# Altium schematic sheet Power.SchDoc
size A4; Organization: Altium Limited; Address1: L3, 12a Rodborough Rd; Address2: Frenchs Forest; Address3: NSW; Address4: Australia 2086
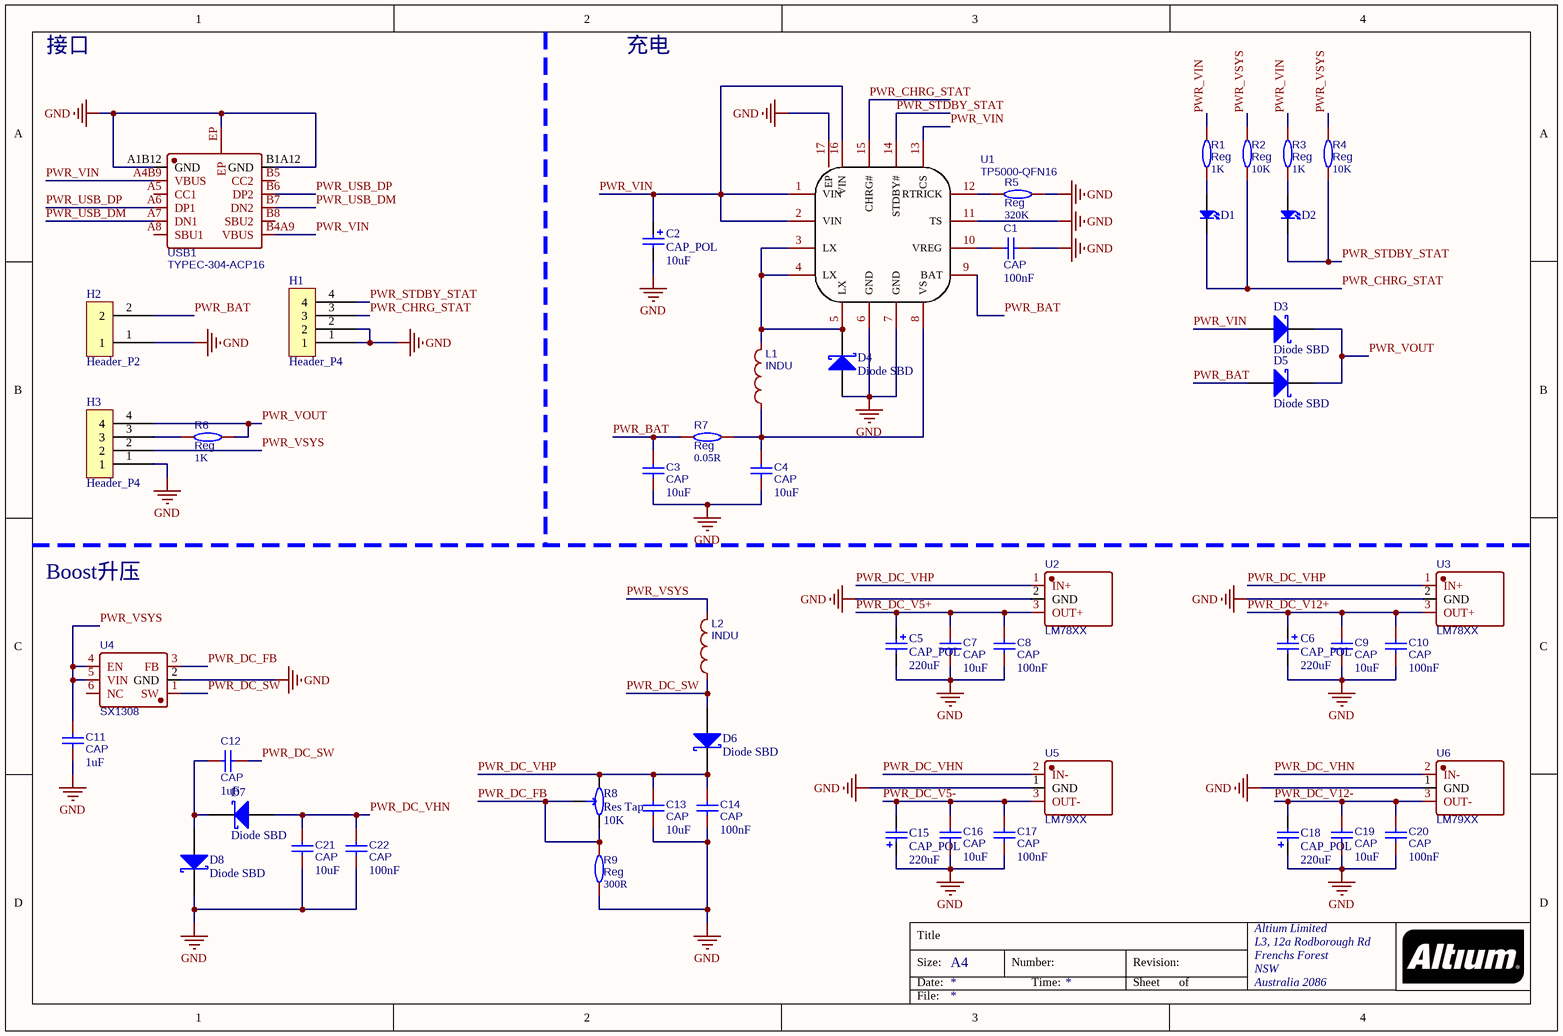
[diagram p0: Power.SchDoc]

## Parts
C1  CAP  value 100nF  [C0603]
C2  CAP_POL  value 10uF  [CP1206]
C3  CAP  value 10uF  [C0603]
C4  CAP  value 10uF  [C0603]
C5  CAP_POL  value 220uF  [CAP_SMD_6.3mm]
C6  CAP_POL  value 220uF  [CAP_SMD_6.3mm]
C7  CAP  value 10uF  [C0603]
C8  CAP  value 100nF  [C0603]
C9  CAP  value 10uF  [C0603]
C10  CAP  value 100nF  [C0603]
C11  CAP  value 1uF  [C0603]
C12  CAP  value 1uF  [C0603]
C13  CAP  value 10uF  [C0603]
C14  CAP  value 100nF  [C0603]
C15  CAP_POL  value 220uF  [CAP_SMD_6.3mm]
C16  CAP  value 10uF  [C0603]
C17  CAP  value 100nF  [C0603]
C18  CAP_POL  value 220uF  [CAP_SMD_6.3mm]
C19  CAP  value 10uF  [C0603]
C20  CAP  value 100nF  [C0603]
C21  CAP  value 10uF  [C0603]
C22  CAP  value 100nF  [C0603]
D1  LED  [LED0603_Side]  (value not drawn)
D2  LED  [LED0603_Side]  (value not drawn)
D3  Diode SBD  [SMA_L4.3]
D4  Diode SBD  [SMA_L4.3]
D5  Diode SBD  [SMA_L4.3]
D6  Diode SBD  [SMA_L4.3]
D7  Diode SBD  [SMA_L4.3]
D8  Diode SBD  [SMA_L4.3]
H1  Header_P4  [PH_4Pin]
H2  Header_P2  [XH_2Pin]
H3  Header_P4  [PH_4Pin]
L1  INDU  [SMD_L7.1]
L2  INDU  [SMD_L7.1]
R1  Reg  value 1K  [R0603]
R2  Reg  value 10K  [R0603]
R3  Reg  value 1K  [R0603]
R4  Reg  value 10K  [R0603]
R5  Reg  value 320K  [R0603]
R6  Reg  value 1K  [R0603]
R7  Reg  value 0.05R  [R2512]
R8  Res Tap  value 10K  [RES_TAP_HOR]
R9  Reg  value 300R  [R0603]
U1  TP5000-QFN16  [QFN-16_L4.0-W4.0-P0.65-BL-EP2.2]
U2  LM78XX  [TO-220-3_2.54_HOR]
U3  LM78XX  [TO-220-3_2.54_HOR]
U4  SX1308  [SOT-23-6]
U5  LM79XX  [TO-220-3_2.54_HOR]
U6  LM79XX  [TO-220-3_2.54_HOR]
USB1  TYPEC-304-ACP16  [USB-C-SMD_TYPE-C-16P]

## Nets
GND: C1.2 C2.2 C3.2 C4.2 C5.2 C6.2 C7.2 C8.2 C9.2 C10.2 C11.2 C13.2 C14.2 C15.1 C16.2 C17.2 C18.1 C19.2 C20.2 C21.2 C22.2 D4.2(A) D8.1(K) H1.1 H1.2 H2.1 H3.1 R5.2 R9.1 U1.6(GND) U1.7(GND) U1.11(TS) U1.17(EP) U2.2(GND) U3.2(GND) U4.2(GND) U5.1(GND) U6.1(GND) USB1.A1B12(GND) USB1.B1A12(GND) USB1.EP
PWR_BAT: C3.1 D5.2(A) H2.2 R7.1 U1.9(BAT)
PWR_CHRG_STAT: D1.1(K) H1.3 R2.1 U1.15(CHRG#)
PWR_DC_FB: R8.1(A) R8.3(TAP) R9.2 U4.3(FB)
PWR_DC_SW: C12.1 D6.2(A) L2.1 U4.1(SW)
PWR_DC_V5+: C5.1 C7.1 C8.1 U2.3(OUT+)
PWR_DC_V5-: C15.2 C16.1 C17.1 U5.3(OUT-)
PWR_DC_V12+: C6.1 C9.1 C10.1 U3.3(OUT+)
PWR_DC_V12-: C18.2 C19.1 C20.1 U6.3(OUT-)
PWR_DC_VHN: C21.1 C22.1 D7.2(A) U5.2(IN-) U6.2(IN-)
PWR_DC_VHP: C13.1 C14.1 D6.1(K) R8.2(B) U2.1(IN+) U3.1(IN+)
PWR_STDBY_STAT: D2.1(K) H1.4 R4.1 U1.14(STDBY#)
PWR_USB_DM: USB1.A7(DN1) USB1.B7(DN2)
PWR_USB_DP: USB1.A6(DP1) USB1.B6(DP2)
PWR_VIN: C2.1 D3.2(A) R1.2 R3.2 U1.1(VIN) U1.2(VIN) U1.13(CS) U1.16(VIN) USB1.A4B9(VBUS) USB1.B4A9(VBUS)
PWR_VOUT: D3.1(K) D5.1(K) H3.4 R6.1
PWR_VSYS: C11.1 H3.2 L2.2 R2.2 R4.2 U4.4(EN) U4.5(VIN)
NetC1_1: C1.1 U1.10(VREG)
NetC4_1: C4.1 L1.1 R7.2 U1.8(VS)
NetC12_2: C12.2 D7.1(K) D8.2(A)
NetD1_2: D1.2(A) R1.1
NetD2_2: D2.2(A) R3.1
NetD4_1: D4.1(K) L1.2 U1.3(LX) U1.4(LX) U1.5(LX)
NetH3_3: H3.3 R6.2
NetR5_1: R5.1 U1.12(RTRICK)

Not connected (* = marked no-connect by the designer): U4 6(NC); USB1 A5(CC1) A8(SBU1) B5(CC2) B8(SBU2)

## Notes on the sheet
- 接口
- 充电
- Boost升压
- Title
- Size:
- Date:
- A4
- Number:
- Time:
- Revision:
- Sheet
- of
- File:

## Library data of the parts
C1 C3 C4 C7-C14 C16 C17 C19-C22 = CAP: BOM_Manufacturer: Huaxin S&T; BOM_Manufacturer Part: 0603B103K101CT; nameAlias: Capacitance; Contributor: LCSC; BOM_Supplier: LCSC; BOM_Supplier Part: C302008; spicePre: C; spiceSymbolName: 0603B103K101CT
C2 C5 C6 C15 C18 = CAP_POL: 极性电容
D1 D2 = LED0: Published: 8-Jun-2000; LatestRevisionDate: 08-Jul-2005; LatestRevisionNote: Mech Layer 1 removed.; PackageReference: LED-0; Publisher: Altium Limited; PackageDescription: LED; 2 Leads
D3-D8 = Diode SBD: Schottky Rectifier; Note: Terminal 2 is the TAB and is electrically connected to the cathode; Published: 8-Jun-2000; LatestRevisionDate: 17-Jul-2002; LatestRevisionNote: Re-released for DXP Platform.; DatasheetVersion: PD-2.057B; PackageVersion: Feb-1998; PackageReference: TO-220AC; Publisher: Altium Limited; PackageDescription: TO, Thru-Hole, Vertical, Heatsink Mounted; 3 In-Line Leads (1 Absent); Pitch 2.54 mm; ComponentLink1Description: Manufacturer Link; ComponentLink1URL: http://www.irf.com/; ComponentLink2Description: Datasheet; ComponentLink2URL: http://www.irf.com/product-info/datasheets/data/10tq.pdf
H1 H3 = Header_P4: 4Pin排针
H2 = Header_P2: 2Pin排针
L1 L2 = IND: 电感; BOM_Manufacturer: Sunltech Tech; BOM_Manufacturer Part: SLO0630H150MTT; nameAlias: Inductance; Contributor: LCSC; BOM_Supplier: LCSC; BOM_Supplier Part: C182182; BOM_JLCPCB Part Class: Extended Part; spicePre: L; spiceSymbolName: SLO0630H150MTT; Value: *
R1-R7 R9 = Res: 电阻; BOM_Manufacturer: Viking Tech; BOM_Manufacturer Part: AR03BTCX1002A; nameAlias: Resistance (Ohms); Contributor: LCSC; BOM_Supplier: LCSC; BOM_Supplier Part: C465721; spicePre: R; spiceSymbolName: AR03BTCX1002A
R8 = Res Tap: 可调电阻; Sim Note: Enter the Resistance value and the set point into parameter fields.; Set Position: 0.5; Published: 24-Mar-1999; LatestRevisionDate: 17-Jul-2002; LatestRevisionNote: Re-released for DXP Platform.; PackageReference: VR3; Publisher: Altium Limited; PackageDescription: Variable Resistor, Thru-Hole; 3 Leads
U1 = TP5000-QFN16: BOM_Manufacturer: TOPPOWER; BOM_Supplier: LCSC; BOM_Manufacturer Part: TP5000-QFN16; BOM_Supplier Part: C51699; BOM_JLCPCB Part Class: Extended Part; spicePre: U; spiceSymbolName: TP5000-QFN16
U2 U3 = LM78XX: 三端稳压(正电压); BOM_Manufacturer: HGSEMI(华冠); BOM_Manufacturer Part: LM7812T; Contributor: LCSC; BOM_Supplier: LCSC; BOM_Supplier Part: C2902509; BOM_JLCPCB Part Class: Extended Part; spicePre: U; spiceSymbolName: LM7812T
U4 = SX1308: 升压PWM; BOM_Manufacturer: SX; sourceId: g4Yg9rJ1j; timeStamp: 1472247539; BOM_Supplier: LCSC; BOM_Manufacturer Part: SX1308; BOM_Supplier Part: C78162; BOM_JLCPCB Part Class: Extended Part; spicePre: U; spiceSymbolName: SX1308
U5 U6 = LM79XX: 三端稳压(负电压); BOM_Manufacturer: HGSEMI(华冠); BOM_Manufacturer Part: LM7812T; Contributor: LCSC; BOM_Supplier: LCSC; BOM_Supplier Part: C2902509; BOM_JLCPCB Part Class: Extended Part; spicePre: U; spiceSymbolName: LM7812T
USB1 = USB_TYPEC_12P: 全引脚USB TYPEC母座; BOM_Manufacturer: XUNPU(讯普); Contributor: LCSC; BOM_Supplier: LCSC; BOM_Supplier Part: C2982555; BOM_Manufacturer Part: TYPEC-304-ACP16; BOM_JLCPCB Part Class: Extended Part; spicePre: U; spiceSymbolName: TYPEC-304-ACP16